# EAGLE design proc (EAGLE 9.4.2)

## Sheet 1 of 2
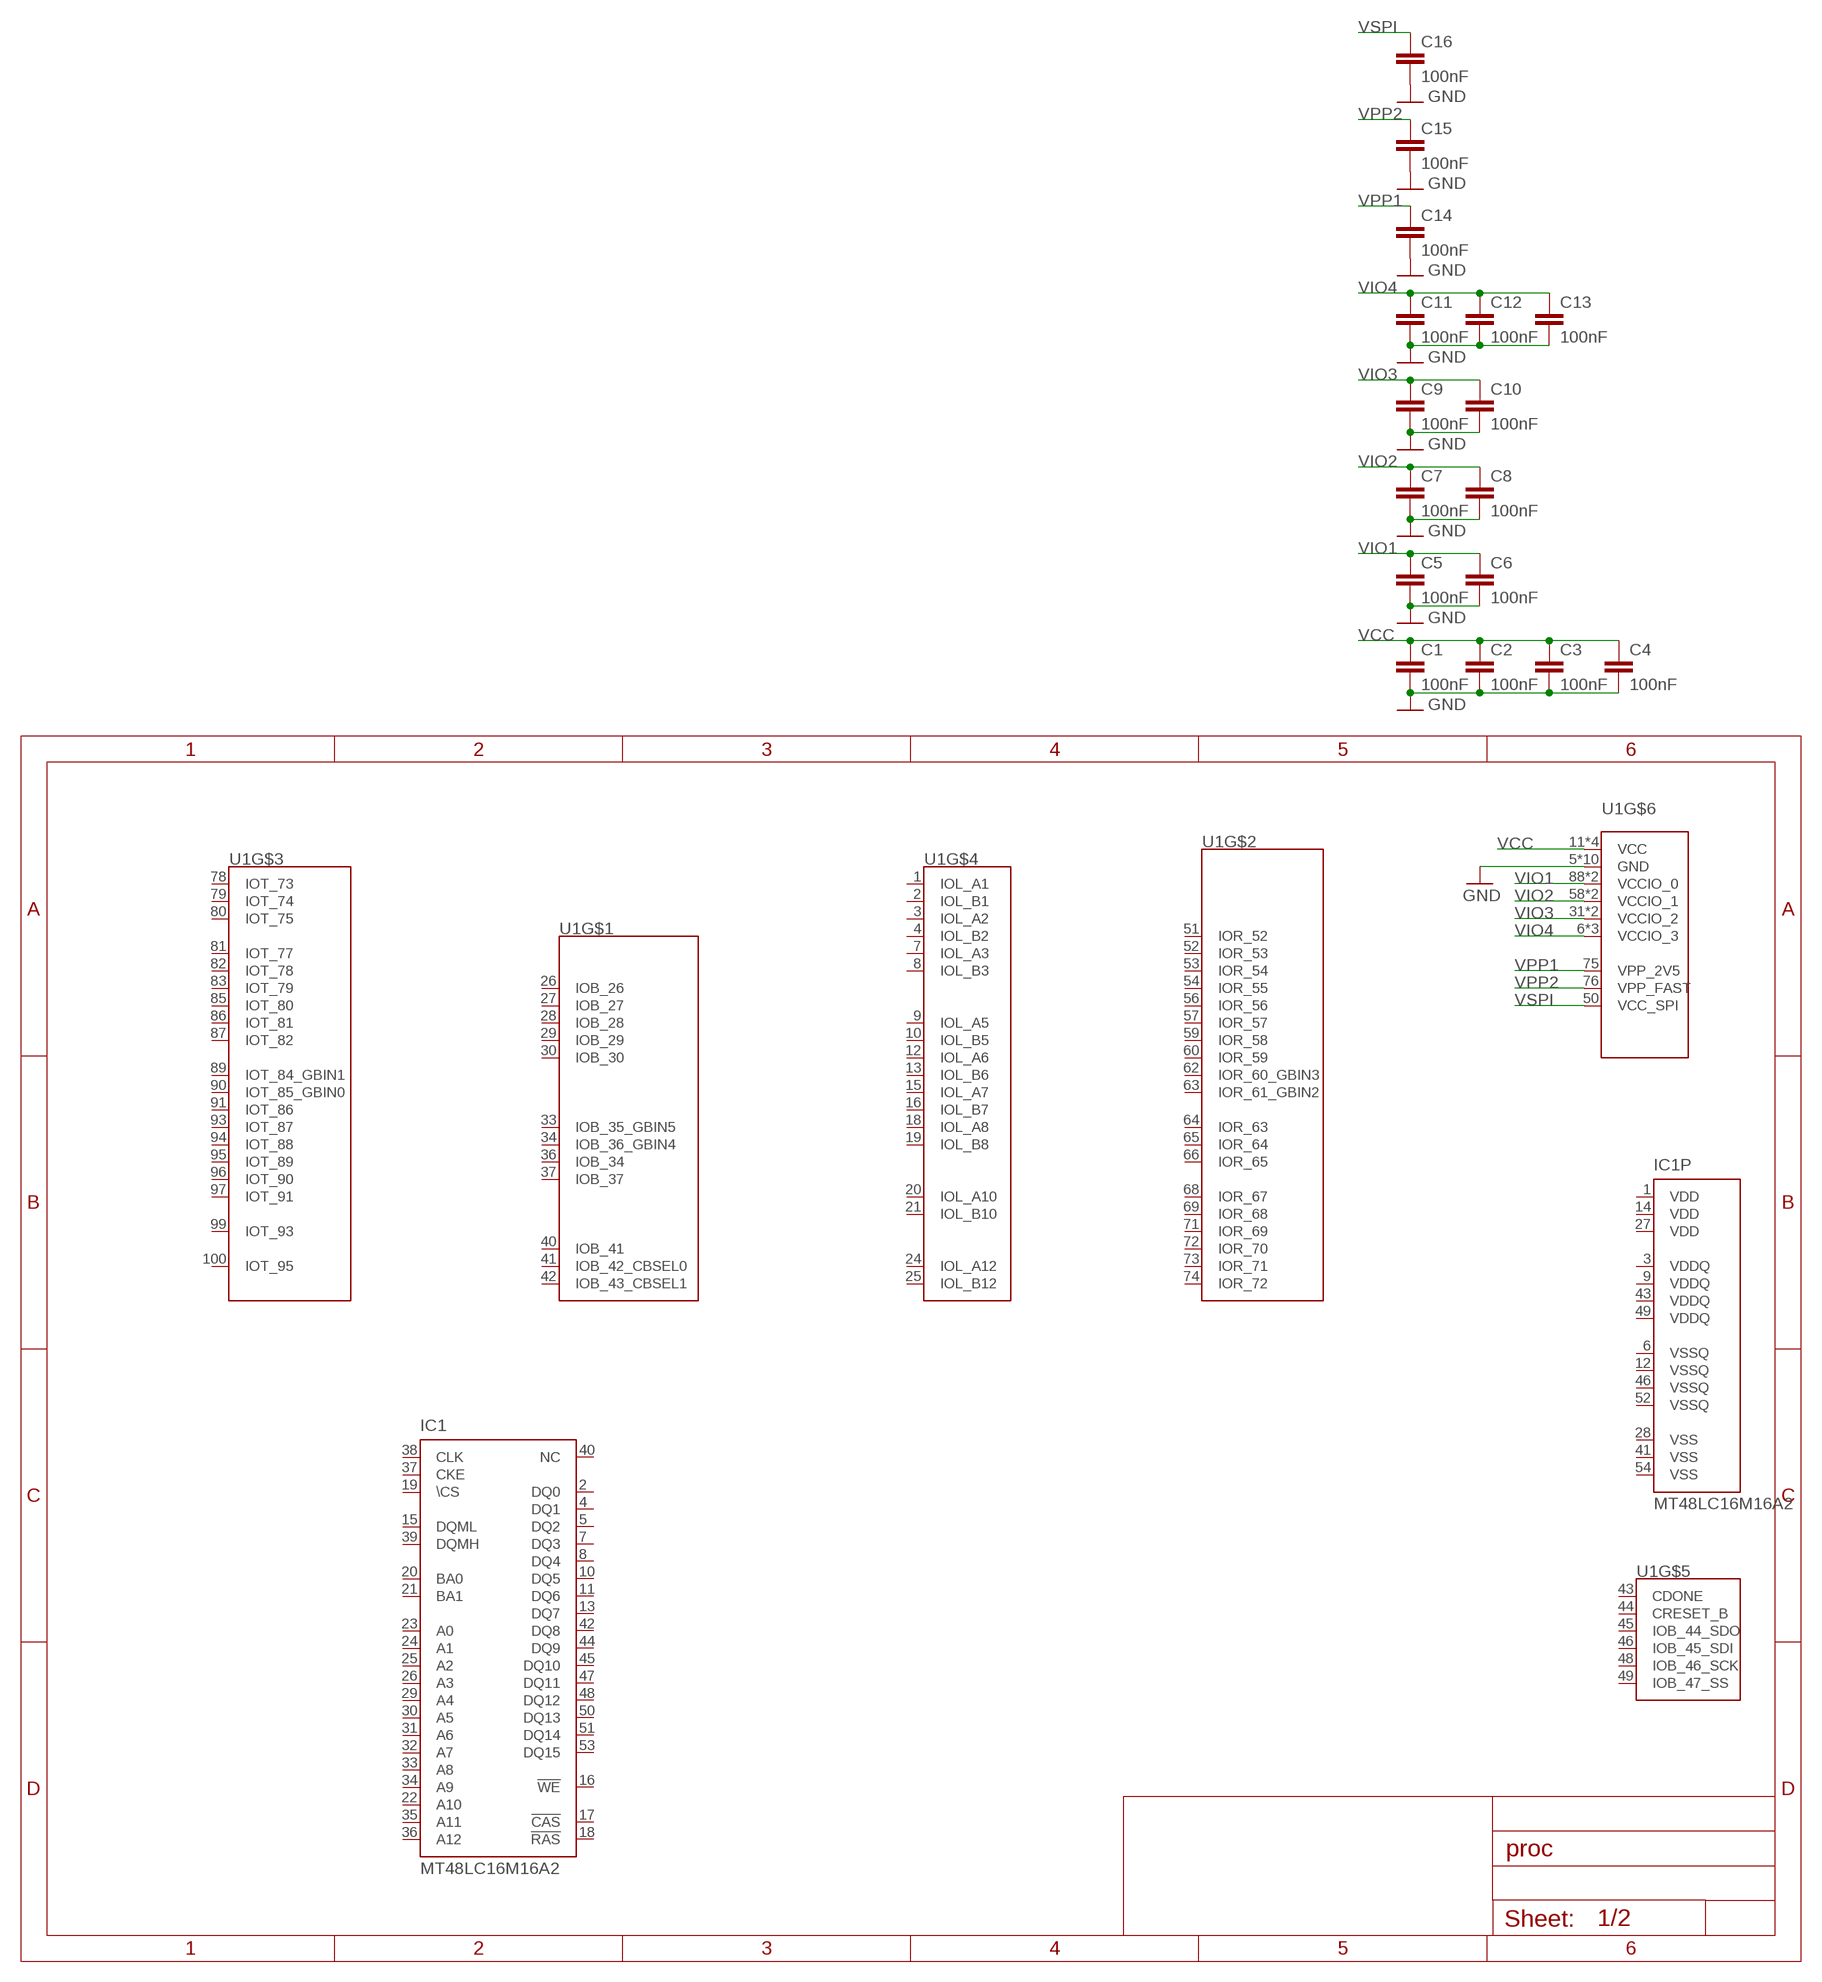
[diagram p0: schematic, sheet 1]

### Parts
C1  100nF  C-EUC0603  [C0603]
C2  100nF  C-EUC0603  [C0603]
C3  100nF  C-EUC0603  [C0603]
C4  100nF  C-EUC0603  [C0603]
C5  100nF  C-EUC0603  [C0603]
C6  100nF  C-EUC0603  [C0603]
C7  100nF  C-EUC0603  [C0603]
C8  100nF  C-EUC0603  [C0603]
C9  100nF  C-EUC0603  [C0603]
C10  100nF  C-EUC0603  [C0603]
C11  100nF  C-EUC0603  [C0603]
C12  100nF  C-EUC0603  [C0603]
C13  100nF  C-EUC0603  [C0603]
C14  100nF  C-EUC0603  [C0603]
C15  100nF  C-EUC0603  [C0603]
C16  100nF  C-EUC0603  [C0603]
IC1  MT48LC16M16A2  [TSOP54-400]
U1  ICE40-HX1K-100VQ  [QFP50P1600X1600X120-100]

### Nets
GND: C1.2 C2.2 C3.2 C4.2 C5.2 C6.2 C7.2 C8.2 C9.2 C10.2 C11.2 C12.2 C13.2 C14.2 C15.2 C16.2 U1.5(GND) U1.17(GND) U1.23(GND) U1.32(GND) U1.39(GND) U1.47(GND) U1.55(GND) U1.70(GND) U1.84(GND) U1.98(GND)
VCC: C1.1 C2.1 C3.1 C4.1 U1.11(VCC) U1.35(VCC) U1.61(VCC) U1.77(VCC)
VIO1: C5.1 C6.1 U1.88(VCCIO_0) U1.92(VCCIO_0)
VIO2: C7.1 C8.1 U1.58(VCCIO_1) U1.67(VCCIO_1)
VIO3: C9.1 C10.1 U1.31(VCCIO_2) U1.38(VCCIO_2)
VIO4: C11.1 C12.1 C13.1 U1.6(VCCIO_3) U1.14(VCCIO_3) U1.22(VCCIO_3)
VPP1: C14.1 U1.75(VPP_2V5)
VPP2: C15.1 U1.76(VPP_FAST)
VSPI: C16.1 U1.50(VCC_SPI)
Unconnected: IC1.2(DQ0) IC1.4(DQ1) IC1.5(DQ2) IC1.7(DQ3) IC1.8(DQ4) IC1.10(DQ5) IC1.11(DQ6) IC1.13(DQ7) IC1.15(DQML) IC1.16(!WE) IC1.17(!CAS) IC1.18(!RAS) IC1.19(\CS) IC1.20(BA0) IC1.21(BA1) IC1.22(A10) IC1.23(A0) IC1.24(A1) IC1.25(A2) IC1.26(A3) IC1.29(A4) IC1.30(A5) IC1.31(A6) IC1.32(A7) IC1.33(A8) IC1.34(A9) IC1.35(A11) IC1.36(A12) IC1.37(CKE) IC1.38(CLK) IC1.39(DQMH) IC1.40(NC) IC1.42(DQ8) IC1.44(DQ9) IC1.45(DQ10) IC1.47(DQ11) IC1.48(DQ12) IC1.50(DQ13) IC1.51(DQ14) IC1.53(DQ15) U1.1(IOL_A1) U1.2(IOL_B1) U1.3(IOL_A2) U1.4(IOL_B2) U1.7(IOL_A3) U1.8(IOL_B3) U1.9(IOL_A5) U1.10(IOL_B5) U1.12(IOL_A6) U1.13(IOL_B6) U1.15(IOL_A7) U1.16(IOL_B7) U1.18(IOL_A8) U1.19(IOL_B8) U1.20(IOL_A10) U1.21(IOL_B10) U1.24(IOL_A12) U1.25(IOL_B12) U1.26(IOB_26) U1.27(IOB_27) U1.28(IOB_28) U1.29(IOB_29) U1.30(IOB_30) U1.33(IOB_35_GBIN5) U1.34(IOB_36_GBIN4) U1.36(IOB_34) U1.37(IOB_37) U1.40(IOB_41) U1.41(IOB_42_CBSEL0) U1.42(IOB_43_CBSEL1) U1.43(CDONE) U1.44(CRESET_B) U1.45(IOB_44_SDO) U1.46(IOB_45_SDI) U1.48(IOB_46_SCK) U1.49(IOB_47_SS) U1.51(IOR_52) U1.52(IOR_53) U1.53(IOR_54) U1.54(IOR_55) U1.56(IOR_56) U1.57(IOR_57) U1.59(IOR_58) U1.60(IOR_59) U1.62(IOR_60_GBIN3) U1.63(IOR_61_GBIN2) U1.64(IOR_63) U1.65(IOR_64) U1.66(IOR_65) U1.68(IOR_67) U1.69(IOR_68) U1.71(IOR_69) U1.72(IOR_70) U1.73(IOR_71) U1.74(IOR_72) U1.78(IOT_73) U1.79(IOT_74) U1.80(IOT_75) U1.81(IOT_77) U1.82(IOT_78) U1.83(IOT_79) U1.85(IOT_80) U1.86(IOT_81) U1.87(IOT_82) U1.89(IOT_84_GBIN1) U1.90(IOT_85_GBIN0) U1.91(IOT_86) U1.93(IOT_87) U1.94(IOT_88) U1.95(IOT_89) U1.96(IOT_90) U1.97(IOT_91) U1.99(IOT_93) U1.100(IOT_95)

## Sheet 2 of 2

## Power pins joined to a net without a drawn wire
VDD: IC1.1(VDD) IC1.14(VDD) IC1.27(VDD)
VDDQ: IC1.3(VDDQ) IC1.9(VDDQ) IC1.43(VDDQ) IC1.49(VDDQ)
VSS: IC1.28(VSS) IC1.41(VSS) IC1.54(VSS)
VSSQ: IC1.6(VSSQ) IC1.12(VSSQ) IC1.46(VSSQ) IC1.52(VSSQ)

## Library data of the parts
C1-C16 = rcl:C-EU: CAPACITOR, European symbol; SPICEPREFIX: C
IC1 = parts-alliance_mem:MT48LC16M16A2: 256Mb: x16 SDRAM MT48LC16M16A2 - 4 Meg x 16 x 4 banks Source: http://download.micron.com/pdf/datasheets/dram/sdram/256MSDRAM.pdf; OC_FARNELL: unknown; OC_NEWARK: unknown
U1 = parts-lattice:ICE40-HX1K-100VQ

## Board
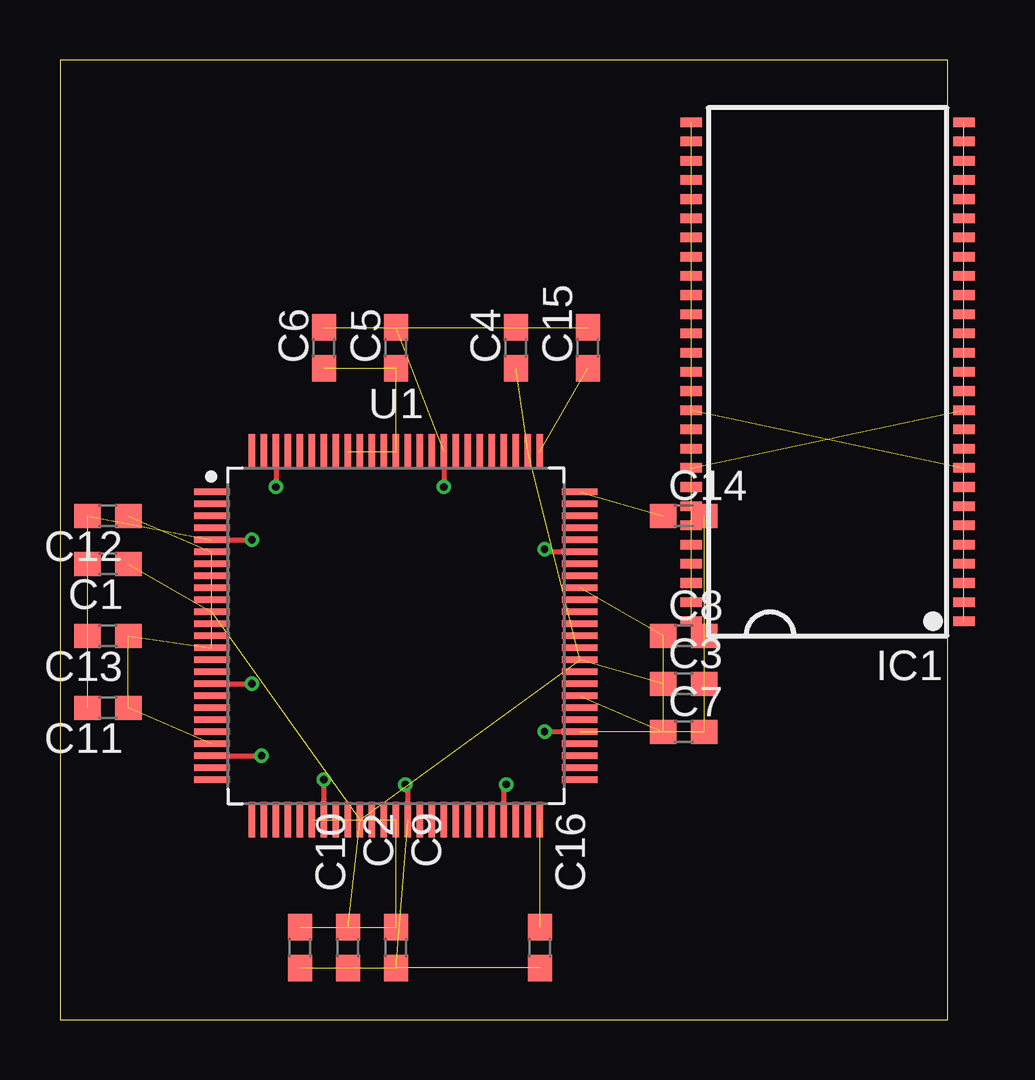
[diagram p1: board, top side]
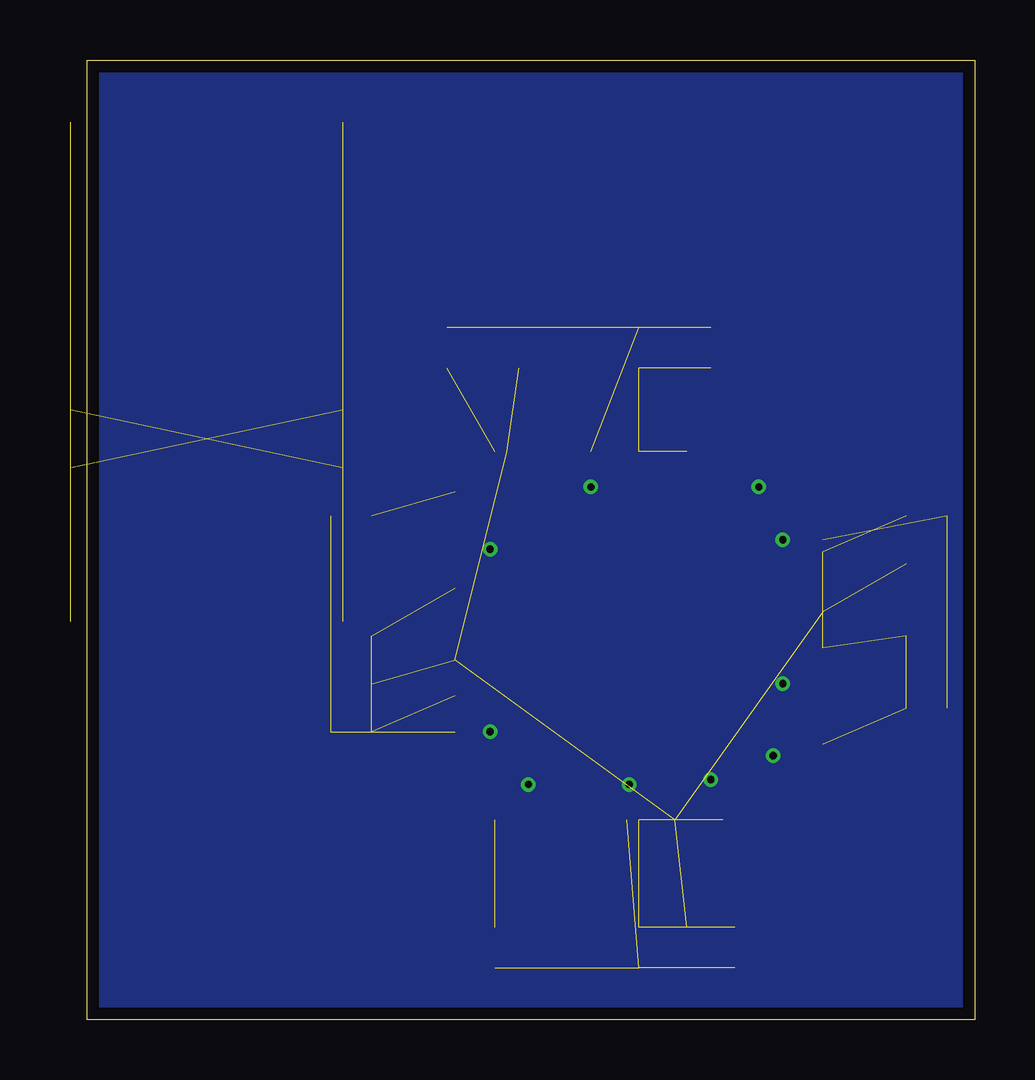
[diagram p2: board, bottom side, seen from below]

Size 37 x 40 mm. Coordinates in mm from the lower left corner, seen from the top.
Outline: 0,0 37,0 37,40 0,40 0,0
Copper layers (1*16): Top 0.035mm / dielectric 0.9mm / Bottom 0.035mm
Design rules "default *": minimum track width 6mil, minimum drill 0.2mm, track to track 6mil, track to pad 6mil, pad to pad 6mil, via to via 6mil, smd to smd 6mil, copper to edge 0.5mm, drill to drill 6mil, minimum pad ring 6mil, minimum via ring 6mil, stop-mask expansion 4mil, vias tented up to drill 0.4mm, thermal gap 10mil

### Footprints (pad centres in the part's own frame; a part is rotated, then mirrored left to right if it is on the bottom)
C0603 = smd 1.1 x 1: 1 -0.85,0; 2 0.85,0
TSOP54-400 = smd 0.4 x 0.9: 1 -10.4,-5.68; 2 -9.6,-5.68; 3 -8.8,-5.68; 4 -8,-5.68; 5 -7.2,-5.68; 6 -6.4,-5.68; 7 -5.6,-5.68; 8 -4.8,-5.68; 9 -4,-5.68; 10 -3.2,-5.68; 11 -2.4,-5.68; 12 -1.6,-5.68; 13 -0.8,-5.68; 14 0,-5.68; 15 0.8,-5.68; 16 1.6,-5.68; 17 2.4,-5.68; 18 3.2,-5.68; 19 4,-5.68; 20 4.8,-5.68; 21 5.6,-5.68; 22 6.4,-5.68; 23 7.2,-5.68; 24 8,-5.68; 25 8.8,-5.68; 26 9.6,-5.68; 27 10.4,-5.68; 28 10.4,5.68; 29 9.6,5.68; 30 8.8,5.68; 31 8,5.68; 32 7.2,5.68; 33 6.4,5.68; 34 5.6,5.68; 35 4.8,5.68; 36 4,5.68; 37 3.2,5.68; 38 2.4,5.68; 39 1.6,5.68; 40 0.8,5.68; 41 0,5.68; 42 -0.8,5.68; 43 -1.6,5.68; 44 -2.4,5.68; 45 -3.2,5.68; 46 -4,5.68; 47 -4.8,5.68; 48 -5.6,5.68; 49 -6.4,5.68; 50 -7.2,5.68; 51 -8,5.68; 52 -8.8,5.68; 53 -9.6,5.68; 54 -10.4,5.68
QFP50P1600X1600X120-100 = smd 1.488 x 0.28: 1 -7.67,6; 2 -7.67,5.5; 3 -7.67,5; 4 -7.67,4.5; 5 -7.67,4; 6 -7.67,3.5; 7 -7.67,3; 8 -7.67,2.5; 9 -7.67,2; 10 -7.67,1.5; 11 -7.67,1; 12 -7.67,0.5; 13 -7.67,0; 14 -7.67,-0.5; 15 -7.67,-1; 16 -7.67,-1.5; 17 -7.67,-2; 18 -7.67,-2.5; 19 -7.67,-3; 20 -7.67,-3.5; 21 -7.67,-4; 22 -7.67,-4.5; 23 -7.67,-5; 24 -7.67,-5.5; 25 -7.67,-6; 51 7.67,-6; 52 7.67,-5.5; 53 7.67,-5; 54 7.67,-4.5; 55 7.67,-4; 56 7.67,-3.5; 57 7.67,-3; 58 7.67,-2.5; 59 7.67,-2; 60 7.67,-1.5; 61 7.67,-1; 62 7.67,-0.5; 63 7.67,0; 64 7.67,0.5; 65 7.67,1; 66 7.67,1.5; 67 7.67,2; 68 7.67,2.5; 69 7.67,3; 70 7.67,3.5; 71 7.67,4; 72 7.67,4.5; 73 7.67,5; 74 7.67,5.5; 75 7.67,6 | smd 0.28 x 1.488: 26 -6,-7.67; 27 -5.5,-7.67; 28 -5,-7.67; 29 -4.5,-7.67; 30 -4,-7.67; 31 -3.5,-7.67; 32 -3,-7.67; 33 -2.5,-7.67; 34 -2,-7.67; 35 -1.5,-7.67; 36 -1,-7.67; 37 -0.5,-7.67; 38 0,-7.67; 39 0.5,-7.67; 40 1,-7.67; 41 1.5,-7.67; 42 2,-7.67; 43 2.5,-7.67; 44 3,-7.67; 45 3.5,-7.67; 46 4,-7.67; 47 4.5,-7.67; 48 5,-7.67; 49 5.5,-7.67; 50 6,-7.67; 76 6,7.67; 77 5.5,7.67; 78 5,7.67; 79 4.5,7.67; 80 4,7.67; 81 3.5,7.67; 82 3,7.67; 83 2.5,7.67; 84 2,7.67; 85 1.5,7.67; 86 1,7.67; 87 0.5,7.67; 88 0,7.67; 89 -0.5,7.67; 90 -1,7.67; 91 -1.5,7.67; 92 -2,7.67; 93 -2.5,7.67; 94 -3,7.67; 95 -3.5,7.67; 96 -4,7.67; 97 -4.5,7.67; 98 -5,7.67; 99 -5.5,7.67; 100 -6,7.67

### Placement (x,y rotation side)
C1  2,19 180 top
C2  12,3 270 top
C3  26,14 0 top
C4  19,28 90 top
C5  14,28 90 top
C6  11,28 90 top
C7  26,12 0 top
C8  26,16 0 top
C9  14,3 270 top
C10  10,3 270 top
C11  2,13 180 top
C12  2,21 180 top
C13  2,16 180 top
C14  26,21 0 top
C15  22,28 90 top
C16  20,3 270 top
IC1  32,27 90 top
U1  14,16 0 top

### Tracks (layer width: path | path; a pad name or v marks a point on that pad's centre or on a via)
GND  (via drill 0.3)  (16 unrouted)
  Top 0.2: U1.39 14.5,9.7 v14.4,9.8 | U1.47 18.5,9.7 v18.6,9.8 | U1.55 v20.2,12 | U1.70 20.3,19.5 v20.2,19.6 | U1.84 v16,22.2 | U1.98 v9,22.2 | U1.5 v8,20 | U1.17 v8,14 | U1.23 v8.4,11 | U1.32 v11,10
  pour Bottom: -1,-1 38,-1 38,41 -1,41
VCC  (7 unrouted)
VDD  (2 unrouted)
VDDQ  (3 unrouted)
VIO1  (3 unrouted)
VIO2  (3 unrouted)
VIO3  (3 unrouted)
VIO4  (5 unrouted)
VPP1  (1 unrouted)
VPP2  (1 unrouted)
VSPI  (1 unrouted)
VSS  (2 unrouted)
VSSQ  (3 unrouted)